# Altium schematic sheet PF5d_Filter2B.SchDoc
size A
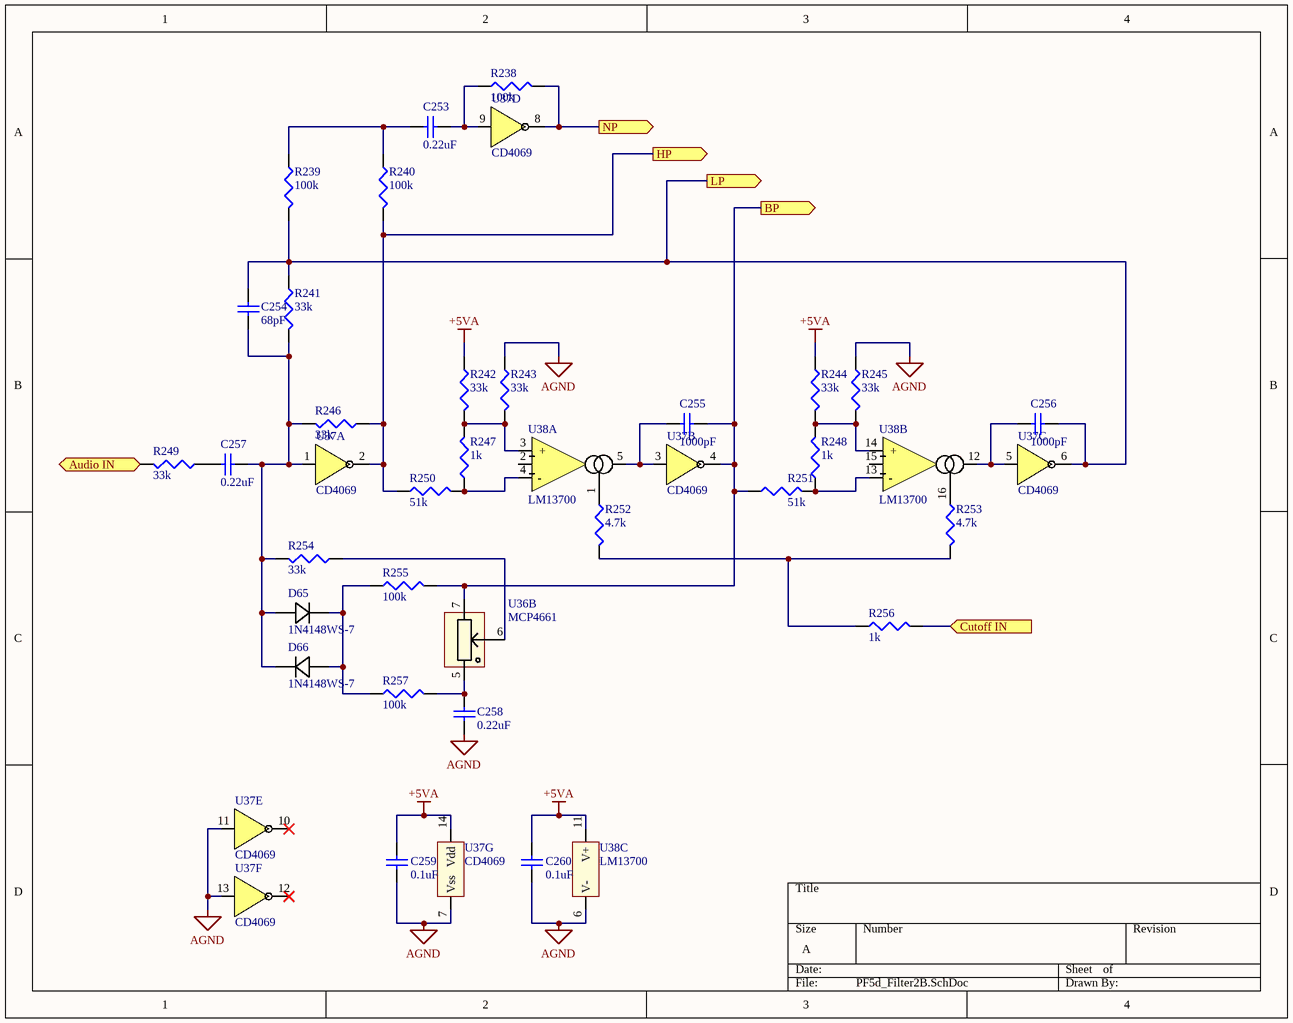
[diagram p0: PF5d_Filter2B.SchDoc]

## Parts
C253  0.22uF  [CAPC1608X08]
C254  68pF  [CAPC1608X08]
C255  1000pF  [CAPC1608X08]
C256  1000pF  [CAPC1608X08]
C257  0.22uF  [CAPC1608X08]
C258  0.22uF  [CAPC1608X08]
C259  0.1uF  [CAPC1608X08]
C260  0.1uF  [CAPC1608X08]
D65  1N4148WS-7  [SOD323-M]
D66  1N4148WS-7  [SOD323-M]
R238  100k  [RESC1608X05]
R239  100k  [RESC1608X05]
R240  100k  [RESC1608X05]
R241  33k  [RESC1608X05]
R242  33k  [RESC1608X05]
R243  33k  [RESC1608X05]
R244  33k  [RESC1608X05]
R245  33k  [RESC1608X05]
R246  33k  [RESC1608X05]
R247  1k  [RESC1608X05]
R248  1k  [RESC1608X05]
R249  33k  [RESC1608X05]
R250  51k  [RESC1608X05]
R251  51k  [RESC1608X05]
R252  4.7k  [RESC1608X05]
R253  4.7k  [RESC1608X05]
R254  33k  [RESC1608X05]
R255  100k  [RESC1608X05]
R256  1k  [RESC1608X05]
R257  100k  [RESC1608X05]
U36  MCP4661  [TSSOP14_MC-M]  (part B of 4)
U37  CD4069  [D14-M]  (parts A,B,C,D,E,F,G of 7)
U38  LM13700  [SO16NB]  (parts A,B,C of 3)

## Ports
Audio IN (in), BP (out), Cutoff IN (in), HP (out), LP (out), NP (out)

## Nets
+5VA: C259.1 C260.1 R242.1 R244.1 U37.14(Vdd) U38.11(V+)
AGND: C258.2 C259.2 C260.2 R243.1 R245.1 U37.7(Vss) U37.11(E) U37.13(F) U38.6(V-)
Audio IN: R249.2 ; port Audio IN
BP: C255.2 R251.1 R255.2 U36.7(P1A) U37.4(~{B}) ; port BP
Cutoff IN: R256.2 ; port Cutoff IN
HP: R240.2 R246.1 R250.1 U37.2(~{A}) ; port HP
LP: C254.2 C256.2 R239.2 R241.1 U37.6(~{C}) ; port LP
NP: R238.2 U37.8(~{D}) ; port NP
NetC253_1: C253.1 R238.1 U37.9(D)
NetC253_2: C253.2 R239.1 R240.1
NetC254_1: C254.1 C257.1 D65.2 D66.1 R241.2 R246.2 R254.2 U37.1(A)
NetC255_1: C255.1 U37.3(B) U38.5(OUT)
NetC256_1: C256.1 U37.5(C) U38.12(OUT)
NetC257_2: C257.2 R249.1
NetC258_1: C258.1 R257.2 U36.5(P1B)
NetD65_1: D65.1 D66.2 R255.1 R257.1
NetR242_2: R242.2 R243.2 R247.2 U38.3(+)
NetR244_2: R244.2 R245.2 R248.2 U38.14(+)
NetR247_1: R247.1 R250.2 U38.4(-)
NetR248_1: R248.1 R251.2 U38.13(-)
NetR252_1: R252.1 U38.1(BIAS)
NetR252_2: R252.2 R253.2 R256.1
NetR253_1: R253.1 U38.16(BIAS)
NetR254_1: R254.1 U36.6(P1W)

Not connected (* = marked no-connect by the designer): U37 10(~{E})* 12(~{F})*; U38 2(Diode_BIAS) 15(Diode_BIAS)

## Library data of the parts
C253 C257 C258 = Cap Semi: Capacitor (Semiconductor SIM Model); Fabricant: MURATA; Fournisseur: Farnell; RefFabricant: GRM188R71A224KA01D; RefFournisseur: 2695909; Value: 0.22uF; Case: 0603 [1608 Metric]; DataSheet: http://www.farnell.com/datasheets/2048635.pdf
C254 = Cap Semi: Capacitor (Semiconductor SIM Model); Fabricant: MURATA; Fournisseur: Farnell; RefFabricant: GRT1885C1H680JA02D; RefFournisseur: 2672146; Value: 68pF; Case: 0603 [1608 Metric]; DataSheet: http://www.farnell.com/datasheets/2165946.pdf
C255 C256 = Cap Semi: Capacitor (Semiconductor SIM Model); Fabricant: MURATA; Fournisseur: Farnell; RefFabricant: GRT1885C1H102JA02D; RefFournisseur: 2672134; Value: 1000pF; Case: 0603 [1608 Metric]; DataSheet: http://www.farnell.com/datasheets/2165937.pdf
C259 C260 = Cap Semi: Capacitor (Semiconductor SIM Model); Fabricant: MURATA; Fournisseur: Farnell; RefFabricant: GRM188F51E104ZA01D; RefFournisseur: 2821272; Value: 0.1uF; Case: 0603 [1608 Metric]; DataSheet: http://www.farnell.com/datasheets/2048672.pdf
D65 D66 = 1N4148WS-7: Diode signaux faibles; Fabricant: ON SEMICONDUCTOR; Fournisseur: Farnell; RefFournisseur: 2453269; DataSheet: http://www.farnell.com/datasheets/2288055.pdf; RefFabricant: 1N4148WS
R238-R240 R255 R257 = Res3: Resistor; Fabricant: TE CONNECTIVITY; Fournisseur: Farnell; RefFabricant: RN73C1J100KBTDF; RefFournisseur: 2687850; Value: 100k; Case: 0603 [1608 Metric]; DataSheet: http://www.farnell.com/datasheets/2189072.pdf
R241-R246 R249 R254 = Res3: Resistor; Fabricant: TE CONNECTIVITY; Fournisseur: Farnell; RefFabricant: CPF-A-0603B33KE1; RefFournisseur: 2483920; Value: 33k; Case: 0603 [1608 Metric]
R247 R248 R256 = Res3: Resistor; Fabricant: TE CONNECTIVITY; Fournisseur: Farnell; RefFabricant: CPF-A-0603B1K0E1; RefFournisseur: 2483880; Value: 1k; Case: 0603 [1608 Metric]; DataSheet: http://www.farnell.com/datasheets/1935020.pdf
R250 R251 = Res3: Resistor; Fabricant: TE CONNECTIVITY; Fournisseur: Farnell; RefFabricant: CPF0603B51KE1; RefFournisseur: 2331265; Value: 51k; Case: 0603 [1608 Metric]; DataSheet: http://www.farnell.com/datasheets/2043335.pdf
R252 R253 = Res3: Resistor; Fabricant: TE CONNECTIVITY; Fournisseur: Farnell; RefFabricant: CPF-A-0603B4K7E1; RefFournisseur: 2483933; Value: 4.7k; Case: 0603 [1608 Metric]; DataSheet: http://www.farnell.com/datasheets/1935020.pdf
U36 = MCP4661: Dual DigiPot non volatile I2C; RefFournisseur: 1840724; RefFabricant: MCP4661-503E/ST; Fournisseur: Farnell; Fabricant: MICROCHIP; DataSheet: http://www.farnell.com/datasheets/2243913.pdf
U37 = CD4069: Hex Inverter; Fabricant: TEXAS INSTRUMENTS; Fournisseur: Farnell; RefFabricant: CD4069UBM; RefFournisseur: 1607751; DataSheet: http://www.ti.com/lit/ds/symlink/cd4069ub.pdf
U38 = LM13700M: Dual Transconductance OpAmp; Fabricant: TEXAS INSTRUMENTS; Fournisseur: Farnell; RefFabricant: LM13700M/NOPB; RefFournisseur: 1468910; DataSheet: http://www.ti.com/lit/ds/symlink/lm13700.pdf